# EAGLE design pm2011(4) (EAGLE 5.11)
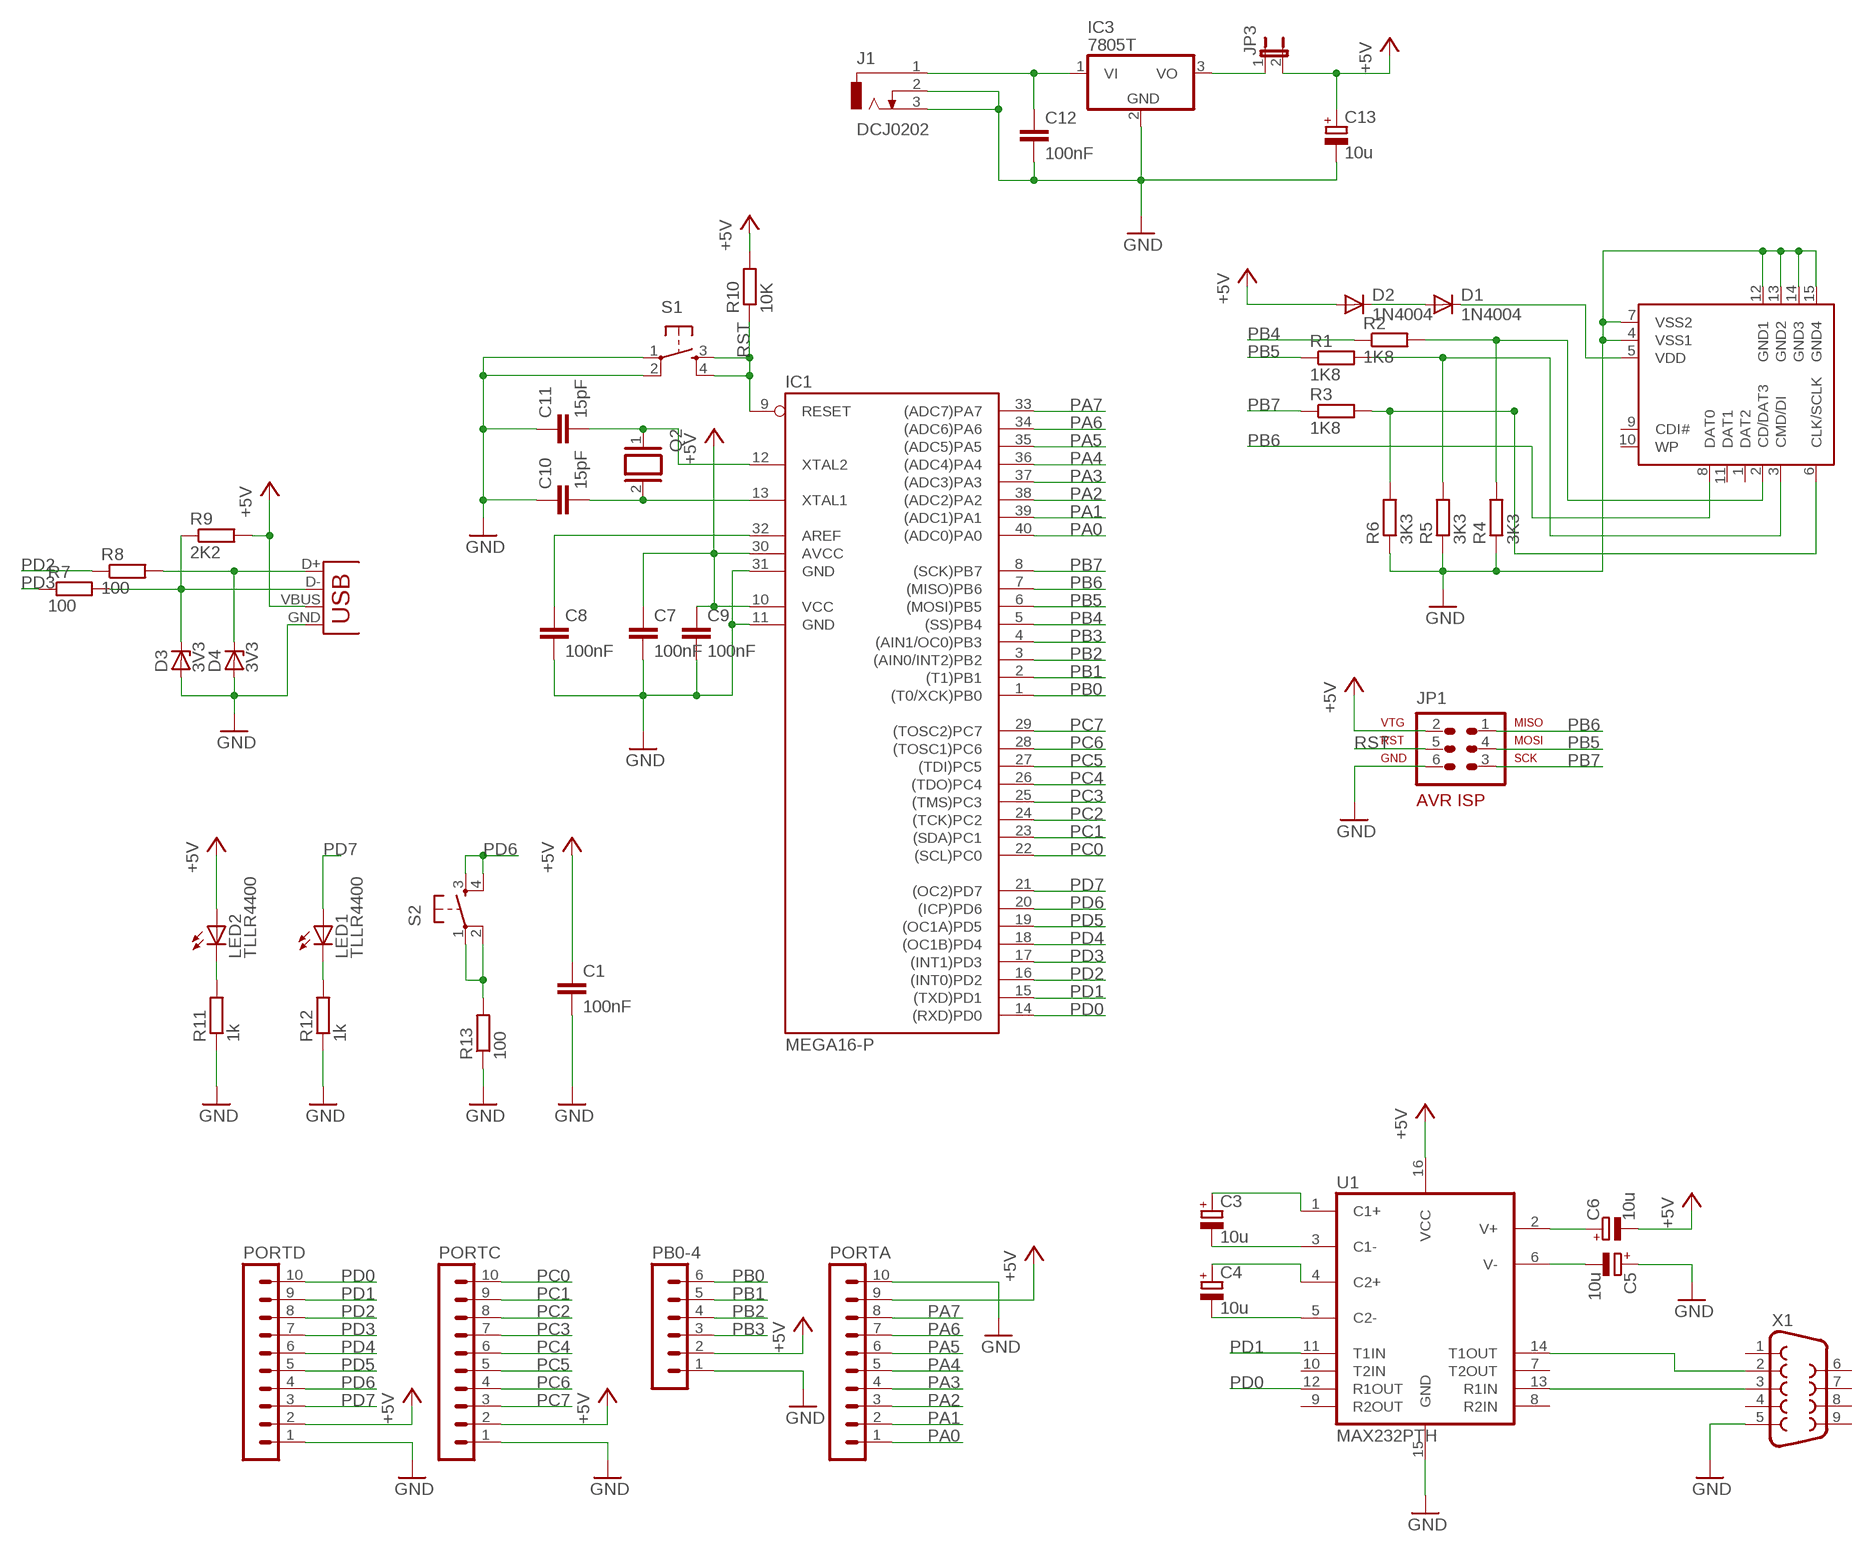
[diagram p0: schematic, sheet 1]

## Parts
C1  100nF  C-EU025-025X050  [C025-025X050]
C3  10u  CPOL-EUE2.5-5  [E2,5-5]
C4  10u  CPOL-EUE2.5-5  [E2,5-5]
C5  10u  CPOL-EUE2.5-5  [E2,5-5]
C6  10u  CPOL-EUE2.5-5  [E2,5-5]
C7  100nF  C-EU025-025X050  [C025-025X050]
C8  100nF  C-EU025-025X050  [C025-025X050]
C9  100nF  C-EU025-025X050  [C025-025X050]
C10  15pF  C-EU025-025X050  [C025-025X050]
C11  15pF  C-EU025-025X050  [C025-025X050]
C12  100nF  C-EU025-025X050  [C025-025X050]
C13  10u  CPOL-EUE2.5-5  [E2,5-5]
D1  1N4004  [DO41-10]
D2  1N4004  [DO41-10]
D3  3V3  ZENER-DIODEDO34-7  [DO34Z7]
D4  3V3  ZENER-DIODEDO34-7  [DO34Z7]
IC1  MEGA16-P  [DIL40]
IC3  7805T  [TO220H]
J1  DCJ0202  [DCJ0202]
JP1  AVR-ISP-6  [AVR-ISP-6]
JP3  JP1E  [JP1]
LED1  TLLR4400  [LED3MM]
LED2  TLLR4400  [LED3MM]
PB0-4  MA06-1  [MA06-1]
PORTA  MA10-1W  [MA10-1W]
PORTC  MA10-1W  [MA10-1W]
PORTD  MA10-1W  [MA10-1W]
Q2  XTAL/S  [QS]
R1  1K8  R-EU_M1206  [M1206]
R2  1K8  R-EU_M1206  [M1206]
R3  1K8  R-EU_M1206  [M1206]
R4  3K3  R-EU_M1206  [M1206]
R5  3K3  R-EU_M1206  [M1206]
R6  3K3  R-EU_M1206  [M1206]
R7  100  R-EU_0204/7  [0204/7]
R8  100  R-EU_0204/7  [0204/7]
R9  2K2  R-EU_0204/7  [0204/7]
R10  10K  R-EU_0204/7  [0204/7]
R11  1k  R-EU_0204/7  [0204/7]
R12  1k  R-EU_0204/7  [0204/7]
R13  100  R-EU_0204/7  [0204/7]
S1  TAC_SWITCHPTH  [TACTILE-PTH]
S2  TAC_SWITCHPTH  [TACTILE-PTH]
U1  MAX232PTH  [DIL16]
U$2  SDCARDVAR2  [SDCMF-10915W010]
X1  DB9  [DB9]
X2  USBPTH  [USB-B-PTH]

## Nets
+5V: C1.1 C6.- C7.1 C9.1 C13.+ D2.A IC1.10(VCC) IC1.30(AVCC) JP1.2 JP3.2 LED2.A PB0-4.2 PORTA.9 PORTC.2 PORTD.2 R9.2 R10.2 U1.16(VCC) X2.VBUS
GND: C1.2 C5.+ C7.2 C8.2 C9.2 C10.1 C11.1 C12.2 C13.- D3.A D4.A IC1.11(GND) IC1.31(GND) IC3.2(GND) J1.2 J1.3 JP1.6 PB0-4.1 PORTA.10 PORTC.1 PORTD.1 R4.1 R5.1 R6.1 R11.1 R12.1 R13.1 S1.1 S1.2 U1.15(GND) U$2.4(VSS1) U$2.7(VSS2) U$2.12(GND1) U$2.13(GND2) U$2.14(GND3) U$2.15(GND4) X1.5 X2.GND
N$1: C3.- U1.3(C1-)
N$2: C3.+ U1.1(C1+)
N$3: C4.- U1.5(C2-)
N$4: C4.+ U1.4(C2+)
N$5: C6.+ U1.2(V+)
N$6: C5.- U1.6(V-)
N$7: U1.14(T1OUT) X1.2
N$8: U1.13(R1IN) X1.3
N$9: D1.C U$2.5(VDD)
N$10: D1.A D2.C
N$11: R1.2 R5.2 U$2.3(CMD/DI)
N$12: R2.2 R4.2 U$2.2(CD/DAT3)
N$13: R3.2 R6.2 U$2.6(CLK/SCLK)
N$14: D4.C R8.2 X2.D+
N$15: D3.C R7.2 R9.1 X2.D-
N$16: C12.1 IC3.1(VI) J1.1
N$17: R13.2 S2.1 S2.2
N$18: IC3.3(VO) JP3.1
N$20: C8.1 IC1.32(AREF)
N$21: C10.2 IC1.13(XTAL1) Q2.2
N$22: C11.2 IC1.12(XTAL2) Q2.1
N$24: LED1.K(C) R12.2
N$25: LED2.K(C) R11.2
PA0: IC1.40((ADC0)PA0) PORTA.1
PA1: IC1.39((ADC1)PA1) PORTA.2
PA2: IC1.38((ADC2)PA2) PORTA.3
PA3: IC1.37((ADC3)PA3) PORTA.4
PA4: IC1.36((ADC4)PA4) PORTA.5
PA5: IC1.35((ADC5)PA5) PORTA.6
PA6: IC1.34((ADC6)PA6) PORTA.7
PA7: IC1.33((ADC7)PA7) PORTA.8
PB0: IC1.1((T0/XCK)PB0) PB0-4.6
PB1: IC1.2((T1)PB1) PB0-4.5
PB2: IC1.3((AIN0/INT2)PB2) PB0-4.4
PB3: IC1.4((AIN1/OC0)PB3) PB0-4.3
PB4: IC1.5((SS)PB4) R2.1
PB5: IC1.6((MOSI)PB5) JP1.4 R1.1
PB6: IC1.7((MISO)PB6) JP1.1 U$2.8(DAT0)
PB7: IC1.8((SCK)PB7) JP1.3 R3.1
PC0: IC1.22((SCL)PC0) PORTC.10
PC1: IC1.23((SDA)PC1) PORTC.9
PC2: IC1.24((TCK)PC2) PORTC.8
PC3: IC1.25((TMS)PC3) PORTC.7
PC4: IC1.26((TDO)PC4) PORTC.6
PC5: IC1.27((TDI)PC5) PORTC.5
PC6: IC1.28((TOSC1)PC6) PORTC.4
PC7: IC1.29((TOSC2)PC7) PORTC.3
PD0: IC1.14((RXD)PD0) PORTD.10 U1.12(R1OUT)
PD1: IC1.15((TXD)PD1) PORTD.9 U1.11(T1IN)
PD2: IC1.16((INT0)PD2) PORTD.8 R8.1
PD3: IC1.17((INT1)PD3) PORTD.7 R7.1
PD4: IC1.18((OC1B)PD4) PORTD.6
PD5: IC1.19((OC1A)PD5) PORTD.5
PD6: IC1.20((ICP)PD6) PORTD.4 S2.3 S2.4
PD7: IC1.21((OC2)PD7) LED1.A PORTD.3
RST: IC1.9(RESET) JP1.5 R10.1 S1.3 S1.4
Unconnected: U1.7(T2OUT) U1.8(R2IN) U1.9(R2OUT) U1.10(T2IN) U$2.1(DAT2) U$2.9(CDI#) U$2.10(WP) U$2.11(DAT1) X1.1 X1.4 X1.6 X1.7 X1.8 X1.9

## Library data of the parts
C1 C7-C12 = resistor:C-EU: CAPACITOR, European symbol
C3-C6 C13 = resistor:CPOL-EU: POLARIZED CAPACITOR, European symbol
D1 D2 = diode:1N4004: DIODE general purpose rectifier, 1 A
D3 D4 = diode:ZENER-DIODE: Z-Diode
IC1 = atmel:MEGA16-P: MICROCONTROLLER 16 Kbytes FLASH 1 kbytes SRAM 512 bytes EEPROM USART 8-channel 10 bit ADC Source: avr.lbr; MPN: ATMEGA16-16PU; OC_FARNELL: 9171142; OC_NEWARK: 01M6885
IC3 = linear:78*: Positive VOLTAGE REGULATOR Source: http://cache.national.com/ds/LM/LM78L05.pdf http://www.fairchildsemi.com/ds/LM/LM7805.pdf
J1 = con-jack:DCJ0202: DC POWER JACK Source: DCJ0202.pdf; OC_FARNELL: unknown; OC_NEWARK: unknown
JP1 = atmel-1:AVR-ISP-6: AVR ISP-6 Serial Programming Header
JP3 = jumper:JP1E: JUMPER
LED1 LED2 = led:TLLR4400: Low Current (2mA) LED 3 mm Tinted Diffused Package color RED Source: Data sheet <http://www.farnell.com/datasheets/391100.pdf>; MF: VISHAY SEMICONDUCTOR; OC_FARNELL: 1612437
PB0-4 = con-lstb:MA06-1: PIN HEADER; OC_FARNELL: unknown; OC_NEWARK: unknown
PORTA PORTC PORTD = con-lstb:MA10-1W: PIN HEADER; OC_FARNELL: unknown; OC_NEWARK: unknown
Q2 = special:XTAL/S: CRYSTAL
R1-R13 = resistor:R-EU_: RESISTOR, European symbol
S1 S2 = SparkFun:TAC_SWITCH: Momentary Switch Button commonly used for reset or general input. Spark Fun Electronics SKU : COM-00097
U1 = SparkFun:MAX232: RS232 Transceiver Very common IC. This is generically called 'MAX232', but works with the 3V equivalent MAX3232 generic ICs. Field tested and mother approved. Spark Fun Electronics SKU : COM-00316 (DIP) and COM-00589 (SMD)
U$2 = kingfont_sdcmf10915w010_covek:SDCARD: SD card connector KINGFONT SDCMF-10915W010
X1 = SparkFun:DB9: DB9 Connector Standard DB9 (D-Sub 9) serial connector. Can be used for CAN bus as well as RS485 and RS232. Footprint production proven. Spark Fun Electronics SKU : PRT-00429
X2 = SparkFun:USB: USB Connectors USB-B-PTH is fully proven SKU : PRT-00139 USB-miniB is fully proven SKU : PRT-00587 USB-A-PCB is untested. USB-A-H is throughly reviewed, but untested. Spark Fun Electronics SKU : PRT-00437 USB-B-SMT is throughly reviewed, but untested. Needs silkscreen touching up. USB-A-S has not been used/tested USB-MB-H has not been used/tested

## Board
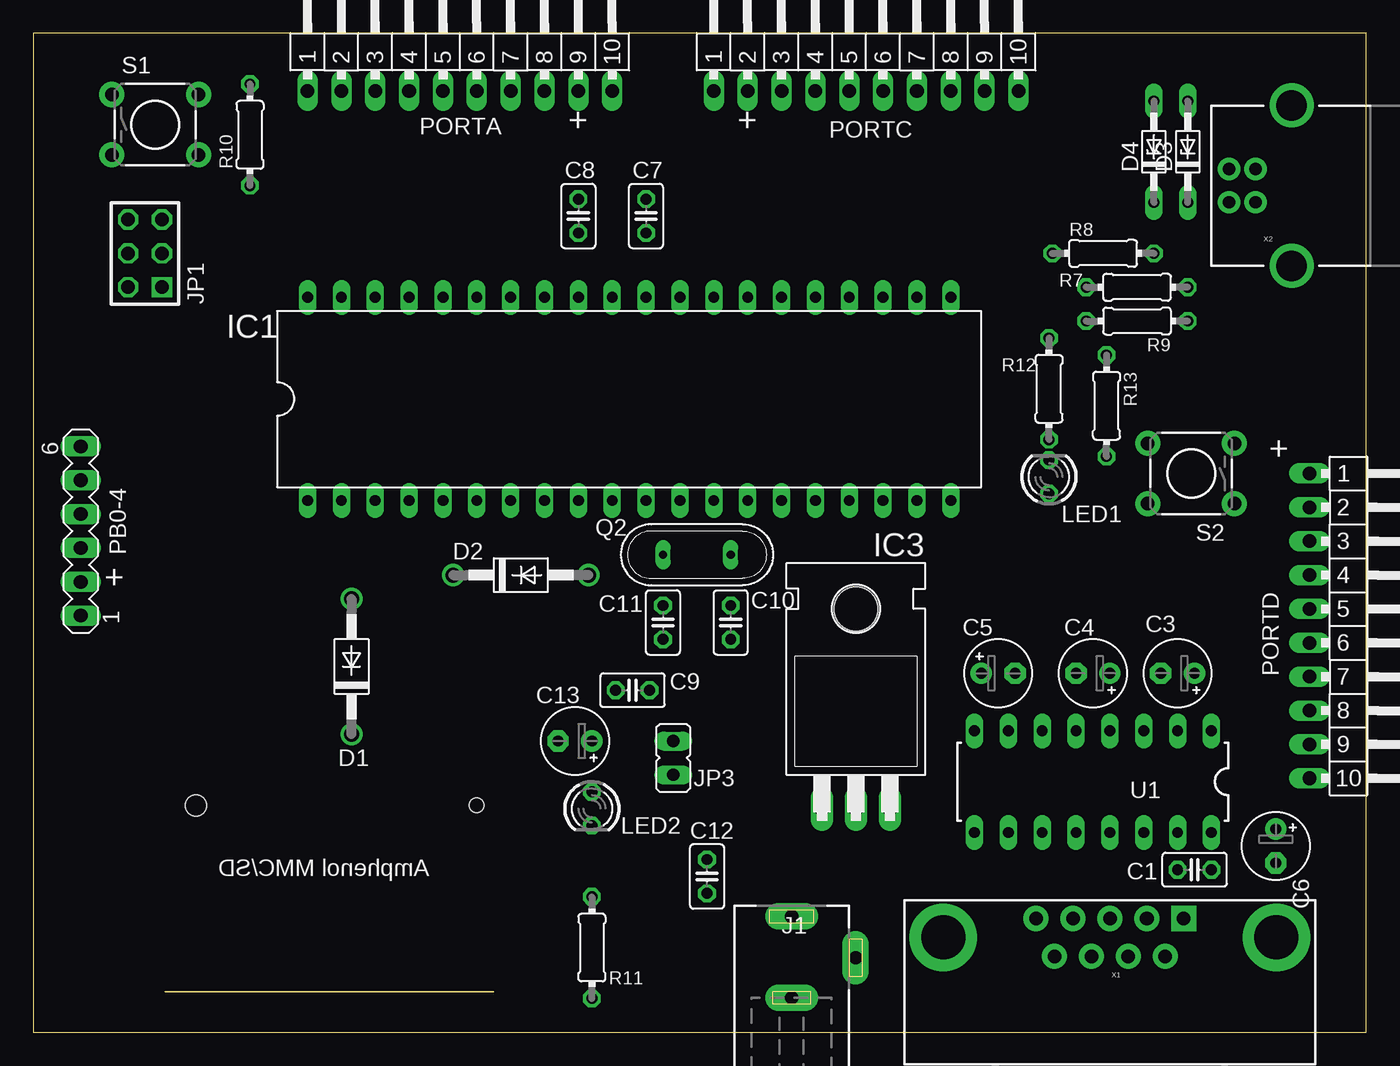
[diagram p1: board, top side]
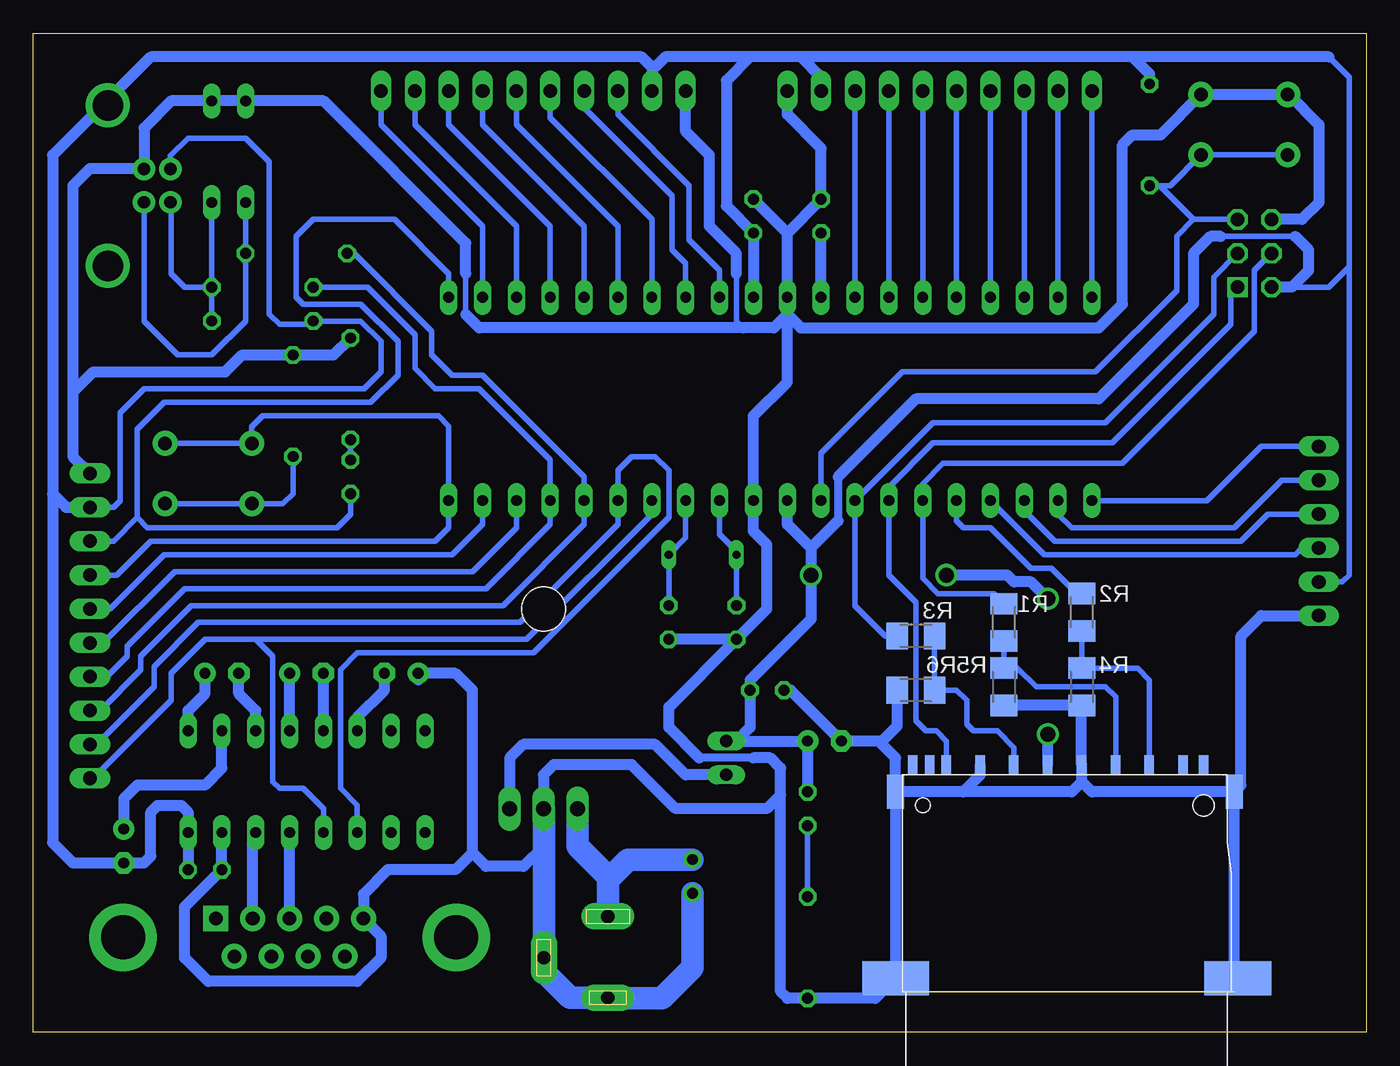
[diagram p2: board, bottom side, seen from below]

Size 100 x 74.92 mm. Coordinates in mm from the lower left corner, seen from the top.
Outline: 0,0 100,0 100,74.92 0,74.92 0,0
Copper layers (1*16): Top 0.035mm / dielectric 1.5mm / Bottom 0.035mm
Design rules "10mils": minimum track width 10mil, minimum drill 24mil, track to track 10mil, track to pad 10mil, pad to pad 10mil, via to via 10mil, smd to smd 10mil, copper to edge 40mil, drill to drill 10mil, minimum pad ring 10mil, minimum via ring 8mil, stop-mask expansion 0mil, vias tented up to drill 0mil, thermal gap 10mil

### Footprints (pad centres in the part's own frame; a part is rotated, then mirrored left to right if it is on the bottom)
C025-025X050 = drill 0.813 octagon: 1 -1.27,0; 2 1.27,0
E2,5-5 = drill 0.813 pad 1.6 round: + -1.27,0 | drill 0.813 pad 1.6 octagon: - 1.27,0
DO41-10 = drill 1.118 round: A 5.08,0; C -5.08,0
DO34Z7 = drill 0.813 long: A 3.81,0; C -3.81,0
DIL40 = drill 0.813 long: 1 -24.13,-7.62; 2 -21.59,-7.62; 3 -19.05,-7.62; 4 -16.51,-7.62; 5 -13.97,-7.62; 6 -11.43,-7.62; 7 -8.89,-7.62; 8 -6.35,-7.62; 9 -3.81,-7.62; 10 -1.27,-7.62; 11 1.27,-7.62; 12 3.81,-7.62; 13 6.35,-7.62; 14 8.89,-7.62; 15 11.43,-7.62; 16 13.97,-7.62; 17 16.51,-7.62; 18 19.05,-7.62; 19 21.59,-7.62; 20 24.13,-7.62; 21 24.13,7.62; 22 21.59,7.62; 23 19.05,7.62; 24 16.51,7.62; 25 13.97,7.62; 26 11.43,7.62; 27 8.89,7.62; 28 6.35,7.62; 29 3.81,7.62; 30 1.27,7.62; 31 -1.27,7.62; 32 -3.81,7.62; 33 -6.35,7.62; 34 -8.89,7.62; 35 -11.43,7.62; 36 -13.97,7.62; 37 -16.51,7.62; 38 -19.05,7.62; 39 -21.59,7.62; 40 -24.13,7.62
TO220H = drill 1.118 long: 1 -2.54,-10.16; 2 0,-10.16; 3 2.54,-10.16 | hole 3.302: 0,4.826
DCJ0202 = drill 1 pad 2 long: 1 0,3.1; 2 4.8,0; 3 0,-3
AVR-ISP-6 = drill 1.016 square: 1 -2.54,-1.27 | drill 1.016 octagon: 2 -2.54,1.27; 3 0,-1.27; 4 0,1.27; 5 2.54,-1.27; 6 2.54,1.27
JP1 = drill 0.914 long: 1 0,-1.27; 2 0,1.27
LED3MM = drill 0.813 octagon: A -1.27,0; K 1.27,0
MA06-1 = drill 1.016 long: 1 -6.35,0; 2 -3.81,0; 3 -1.27,0; 4 1.27,0; 5 3.81,0; 6 6.35,0
MA10-1W = drill 1.016 long: 1 -11.43,0; 2 -8.89,0; 3 -6.35,0; 4 -3.81,0; 5 -1.27,0; 6 1.27,0; 7 3.81,0; 8 6.35,0; 9 8.89,0; 10 11.43,0
QS = drill 0.61 long: 1 -2.54,0; 2 2.54,0
M1206 = smd 1.6 x 2: 1 -1.4,0; 2 1.4,0
0204/7 = drill 0.813 octagon: 1 -3.81,0; 2 3.81,0
TACTILE-PTH = drill 1.016 pad 1.88 round: 1 -3.251,2.261; 2 3.251,2.261; 3 -3.251,-2.261; 4 3.251,-2.261
DIL16 = drill 0.813 long: 1 -8.89,-3.81; 2 -6.35,-3.81; 3 -3.81,-3.81; 4 -1.27,-3.81; 5 1.27,-3.81; 6 3.81,-3.81; 7 6.35,-3.81; 8 8.89,-3.81; 9 8.89,3.81; 10 6.35,3.81; 11 3.81,3.81; 12 1.27,3.81; 13 -1.27,3.81; 14 -3.81,3.81; 15 -6.35,3.81; 16 -8.89,3.81
SDCMF-10915W010 = smd 0.711 x 1.422: 1 8.366,13.462; 2 5.826,13.462; 3 3.286,13.462; 4 0.746,13.462; 5 -1.794,13.462; 6 -4.334,13.462; 7 -6.874,13.462; 8 -9.398,13.462; 9 9.906,13.462; 10 -11.938,13.462; 11 -10.668,13.462 | smd 1.27 x 2.54: 12 12.192,11.43; 15 -13.208,11.43 | smd 5 x 2.54: 13 12.47,-2.54; 14 -13.208,-2.54 | hole 1.6: 9.906,10.414 | hole 1.1: -11.176,10.414
DB9 = drill 1.016 pad 1.88 square: 1 -5.54,-1.42 | drill 1.016 pad 1.88 round: 2 -2.77,-1.42; 3 0,-1.42; 4 2.77,-1.42; 5 5.54,-1.42; 6 -4.15,1.42; 7 -1.38,1.42; 8 1.38,1.42; 9 4.15,1.42 | drill 3.302 pad 5.08 round: G1 -12.5,0; G2 12.5,0
USB-B-PTH = drill 0.914 pad 1.676 round: D+ 0,1.25; D- 1.981,1.25; GND 0,-1.25; VBUS 1.981,-1.25 | drill 2.286 round: P$1 -2.718,-6.02; P$2 -2.718,6.02

### Placement (x,y rotation side)
C1  87.12,12.19 180 top
C3  85.85,26.92 180 top
C4  79.5,26.92 180 top
C5  72.39,26.92 0 top
C6  93.22,13.97 270 top
C7  45.97,61.21 90 top
C8  40.89,61.21 90 top
C9  44.96,25.65 180 top
C10  52.32,30.73 90 top
C11  47.24,30.73 90 top
C12  50.55,11.68 270 top
C13  40.64,21.84 180 top
D1  23.88,27.43 90 top
D2  36.58,34.29 0 top
D3  86.61,66.04 90 top
D4  84.07,66.04 90 top
IC1  44.7,47.5 0 top
IC3  61.72,26.92 0 top
J1  56.9,5.59 0 top
JP1  8.38,58.42 90 top
JP3  48.01,20.57 0 top
LED1  76.2,41.66 90 top
LED2  41.91,16.76 270 top
PB0-4  3.56,37.59 90 top
PORTA  32,70.61 0 top
PORTC  62.48,70.61 0 top
PORTD  95.76,30.48 270 top
Q2  49.78,35.81 0 top
R1  27.18,30.73 270 bottom
R2  21.34,31.5 270 bottom
R3  33.78,29.72 0 bottom
R4  21.34,25.91 90 bottom
R5  27.18,25.91 90 bottom
R6  33.78,25.65 0 bottom
R7  82.8,55.88 0 top
R8  80.26,58.42 0 top
R9  82.8,53.34 180 top
R10  16.26,67.31 90 top
R11  41.91,6.35 90 top
R12  76.2,48.26 270 top
R13  80.52,46.99 270 top
S1  9.14,68.07 0 top
S2  86.87,41.91 180 top
U1  79.5,18.8 180 top
U$2  22.1,6.6 0 bottom
X1  80.77,7.11 180 top
X2  91.69,63.5 180 top

### Tracks (layer width: path | path; a pad name or v marks a point on that pad's centre or on a via)
+5V
  Bottom 0.406: 5.33,59.69 10.92,59.69 | 90.17,48.26 75.18,48.26 73.91,49.53 73.91,51.82 75.44,53.34 R9.2 79.25,53.09 81.53,53.09 82.3,53.85 82.3,65.28 84.07,67.06 88.39,67.06 89.71,65.73 X2.VBUS | 90.17,48.26 90.42,48.26 | PB0-4.2 1.78,33.78 1.27,34.29 1.27,57.4 | 1.27,57.4 1.27,71.63 2.79,73.15 | 5.59,55.88 2.79,55.88 1.27,57.4 | PORTD.2 93.98,39.37 93.47,39.88 93.47,46.48 91.69,48.26 90.17,48.26
  Bottom 0.61: 39.62,41.66 39.62,38.35
  Bottom 0.813: 41.66,36.32 D2.A 41.66,30.99 46.23,26.42 C9.1 46.23,22.86 47.24,21.84 JP3.2 C13.+ LED2.A | 41.66,36.32 43.43,38.1 IC1.10 | 39.62,38.35 41.66,36.32 | 39.62,41.66 33.78,47.5 20.07,47.5 12.95,54.61 12.95,58.42 11.68,59.69 10.92,59.69 | 53.59,72.39 PORTC.2 | 53.59,72.39 54.36,73.15 91.19,73.15 98.55,65.79 98.55,40.39 | C1.1 U1.16 88.39,16.51 88.9,17.02 90.68,17.02 91.19,16.51 91.19,13.21 91.69,12.7 C6.- 97.03,12.7 98.55,14.22 98.55,40.39 | 53.59,72.39 53.34,72.39 52.58,73.15 46.23,73.15 | 42.42,73.15 46.23,73.15 | PORTA.9 40.89,71.63 42.42,73.15 | IC1.30 C7.1 48.01,61.98 48.01,71.37 46.23,73.15 | 2.79,73.15 17.53,73.15 | 17.53,73.15 42.42,73.15 | 5.33,59.69 4.32,58.67 4.32,57.15 5.59,55.88 JP1.2 | R10.2 16.26,71.88 17.53,73.15 | PORTD.2 97.54,39.37 98.55,40.39
GND
  Bottom 0.406: 28.96,20.05 U$2.7 | 67.56,53.85 67.56,56.9 | 47.24,56.9 47.24,53.34 46.74,52.83
  Bottom 0.61: 45.97,20.57 50.04,20.57
  Bottom 0.813: 43.43,53.85 43.43,48.77 45.97,46.23 IC1.11 45.97,37.59 44.96,36.58 44.96,31.75 C11.1 | 43.43,53.85 IC1.31 43.43,59.94 | C11.1 C10.1 | U1.15 C1.2 88.65,9.4 88.65,5.59 86.87,3.81 75.69,3.81 73.91,5.59 73.91,7.21 X1.5 75.23,10.37 73.41,12.19 68.33,12.19 67.06,13.46 | 43.43,59.94 C7.2 | 43.43,59.94 C8.2 40.89,66.29 43.43,68.83 PORTA.10 | PORTC.1 51.05,67.56 49.28,65.79 49.28,60.45 47.24,58.42 47.24,56.9 | 43.43,53.85 44.45,52.83 46.74,52.83 66.55,52.83 67.56,53.85 | 67.56,56.9 67.56,59.18 78.23,69.85 D4.A D3.A 89.66,69.85 91.69,67.82 X2.GND 91.71,64.77 95.76,64.77 97.03,63.5 97.03,48.01 | R12.1 77.47,50.8 R13.1 84.33,50.8 85.6,49.53 95.5,49.53 97.03,48.01 | 43.43,53.85 42.42,52.83 20.07,52.83 18.29,54.61 18.29,66.55 17.53,67.31 15.42,67.31 S1.2 S1.1 5.82,70.33 3.56,68.07 3.56,62.23 4.83,60.96 JP1.6 | 71.12,26.42 C5.+ 68.33,26.92 67.06,25.65 67.06,13.46 | 67.06,13.46 66.04,12.45 63.22,12.45 61.7,13.97 | IC3.2 61.72,19.3 60.96,20.07 55.12,20.07 51.82,16.76 44.96,16.76 43.94,17.78 | 43.94,17.78 43.94,3.05 43.43,2.54 R11.1 36.83,2.54 U$2.14 U$2.15 | 43.94,17.78 43.94,19.81 44.7,20.57 45.97,20.57 | PB0-4.1 7.87,31.24 9.4,29.72 9.4,18.54 U$2.12 | U$2.12 9.91,4.34 U$2.13 | U$2.12 20.57,18.03 21.34,18.8 | 21.34,18.8 21.34,20.05 U$2.4 21.35,24.49 R4.1 R5.1 | 30.23,18.03 22.1,18.03 21.34,18.8 | 30.23,18.03 U$2.15 | 28.96,20.05 28.96,19.3 30.23,18.03 | C9.2 43.18,25.65 C13.- 36.58,21.84 36.45,21.72 | 36.45,21.72 35.31,20.57 U$2.15 | R6.1 35.18,22.98 36.45,21.72 | 50.04,20.57 52.32,22.86 52.32,24.38 C11.1 | 97.03,48.01 97.03,43.18 PORTD.1
  Bottom 1.676: C12.2 50.55,4.83 52.83,2.54 56.85,2.54 J1.3 59.74,2.59 61.72,4.57 61.72,5.56 J1.2 61.7,13.97 61.7,16.74 IC3.2
N$1
  Bottom 0.813: U1.3 83.31,24.13 84.58,25.4 C3.-
N$2
  Bottom 0.813: U1.1 88.39,24.13 87.12,25.4 C3.+
N$3
  Bottom 0.813: U1.5 C4.-
N$4
  Bottom 0.813: U1.4 C4.+
N$5
  Bottom 0.813: U1.2 85.85,19.81 87.12,18.54 92.2,18.54 93.22,17.53 C6.+
N$6
  Bottom 0.813: U1.6 75.69,23.62 73.66,25.65 C5.-
N$7
  Bottom 0.813: X1.2 83.54,14.76 U1.14
N$8
  Bottom 0.813: X1.3 U1.13
N$9
  Bottom 0.813: U$2.5 23.89,22.34 D1.C
N$10
  Bottom 0.813: D1.A 25.15,33.78 26.42,33.78 26.92,34.29 D2.C
N$11
  Bottom 0.406: U$2.3 18.8,20.07 18.8,25.15 19.56,25.91 24.76,25.91 26.16,27.31 R5.2 R1.2
N$12
  Bottom 0.406: R2.2 R4.2 17.15,27.31 16.26,26.42 16.26,20.08 U$2.2
N$13
  Bottom 0.406: R3.2 R6.2 30.73,25.65 29.97,24.89 29.97,23.11 29.46,22.61 27.69,22.61 26.42,21.34 26.42,20.08 U$2.6
N$14
  Bottom 0.406: D4.C R8.2 84.07,53.34 86.61,50.8 89.15,50.8 91.69,53.34 X2.D+
N$15
  Bottom 0.406: R9.1 R7.2 | R7.2 D3.C | R7.2 88.65,55.88 89.66,56.9 89.66,62.2 X2.D-
N$16
  Bottom 1.676: J1.1 56.9,11.43 56.77,11.56 | 56.77,11.56 55.37,12.95 C12.1 | IC3.1 59.18,13.97 56.77,11.56
N$17
  Bottom 0.406: S2.1 S2.2 83.59,39.62 81.28,39.62 80.52,40.39 R13.2
N$18
  Bottom 0.813: 64.26,18.29 IC3.3 64.26,20.57 63.25,21.59 53.34,21.59 51.05,19.3 JP3.1
N$20
  Bottom 0.813: IC1.32 C8.1
N$21
  Bottom 0.406: IC1.13 51.05,37.08 Q2.2 C10.2
N$22
  Bottom 0.406: C11.2 Q2.1 47.24,36.07 48.51,37.34 IC1.12
N$24
  Bottom 0.406: LED1.K R12.2
N$25
  Bottom 0.406: R11.2 LED2.K
PA0
  Bottom 0.406: IC1.40 PORTA.1
PA1
  Bottom 0.406: IC1.39 PORTA.2
PA2
  Bottom 0.406: IC1.38 PORTA.3
PA3
  Bottom 0.406: IC1.37 PORTA.4
PA4
  Bottom 0.406: IC1.36 PORTA.5
PA5
  Bottom 0.406: IC1.35 PORTA.6
PA6
  Bottom 0.406: IC1.34 PORTA.7
PA7
  Bottom 0.406: IC1.33 PORTA.8
PB0
  Bottom 0.406: PB0-4.6 5.08,43.94 | 5.08,43.94 5.33,43.94 | IC1.1 11.94,39.88 7.87,43.94 5.08,43.94
PB1
  Bottom 0.406: PB0-4.5 6.35,41.4 9.91,37.85 22.1,37.85 23.11,38.86 IC1.2
PB2
  Bottom 0.406: PB0-4.4 7.37,38.86 9.4,36.83 23.37,36.83 25.65,39.12 IC1.3
PB3
  Bottom 0.406: IC1.4 24.13,35.81 5.33,35.81 4.83,36.32 PB0-4.3 3.3,36.58
PB4
  Bottom 0.406: R2.1 21.72,32.9 23.62,34.8 25.15,34.8 28.19,37.85 30.23,37.85 30.73,38.35 IC1.5
PB5
  Bottom 0.406: JP1.4 8.38,57.15 8.38,52.58 18.29,42.67 31.75,42.67 33.27,41.15 IC1.6 33.27,34.04 32.13,32.9 27.94,32.9 R1.1
PB6
  Bottom 0.406: JP1.1 10.16,55.37 10.16,53.09 19.05,44.2 32.51,44.2 35.81,40.89 IC1.7 35.81,34.29 33.78,32.26 33.78,23.37 33.02,22.61 32.26,22.61 31.5,21.84 U$2.8
PB7
  Bottom 0.406: R3.1 36.07,29.72 38.35,32 IC1.8 32.51,45.72 19.56,45.72 11.43,53.85 11.43,56.64 JP1.3
PC0
  Bottom 0.406: PORTC.10 73.91,68.07 66.29,60.45 IC1.22
PC1
  Bottom 0.406: PORTC.9 71.37,68.07 63.75,60.45 IC1.23
PC2
  Bottom 0.406: PORTC.8 68.83,68.07 61.21,60.45 IC1.24
PC3
  Bottom 0.406: PORTC.7 66.29,68.07 58.67,60.45 IC1.25
PC4
  Bottom 0.406: PORTC.6 63.75,68.07 56.13,60.45 IC1.26
PC5
  Bottom 0.406: PORTC.5 61.21,68.58 53.59,60.96 IC1.27
PC6
  Bottom 0.406: PORTC.4 58.67,69.34 52.07,62.74 52.07,58.67 51.05,57.66 IC1.28
PC7
  Bottom 0.406: IC1.29 48.51,57.15 50.8,59.44 50.8,63.5 56.13,68.83 PORTC.3
PD0
  Bottom 0.406: IC1.14 53.59,38.86 62.99,29.46 83.31,29.46 | 83.31,29.46 82.04,28.19 82.04,18.8 81.53,18.29 79.76,18.29 78.23,16.76 U1.12 | PORTD.10 95.5,19.05 89.66,24.89 89.66,26.92 87.12,29.46 83.31,29.46
PD1
  Bottom 0.406: U1.11 75.69,17.02 76.96,18.29 76.96,27.18 75.69,28.45 62.48,28.45 52.32,38.61 52.32,42.16 53.34,43.18 55.12,43.18 56.13,42.16 IC1.15 56.13,38.1 63.5,30.73 87.63,30.73 90.93,27.43 90.93,25.91 95.25,21.59 PORTD.9
PD2
  Bottom 0.406: R8.1 75.95,58.42 70.1,52.58 70.1,50.8 68.58,49.28 66.29,49.28 58.67,41.66 IC1.16 58.67,38.1 64.77,32 88.14,32 91.95,28.19 91.95,27.18 95,24.13 PORTD.8
PD3
  Bottom 0.406: 87.63,33.27 66.04,33.27 61.21,38.1 IC1.17 61.21,42.93 66.55,48.26 69.85,48.26 71.37,49.78 71.37,52.32 74.93,55.88 R7.1 | 87.63,33.27 87.88,33.27 | PORTD.7 94.49,26.67 92.96,28.19 92.96,28.96 88.65,33.27 87.63,33.27
PD4
  Bottom 0.406: IC1.18 63.75,37.85 67.06,34.54 89.41,34.54 94.74,29.21 PORTD.6
PD5
  Bottom 0.406: IC1.19 66.29,38.1 68.58,35.81 90.17,35.81 94.23,31.75 PORTD.5
PD6
  Bottom 0.406: S2.3 S2.4 83.62,45.41 82.8,46.23 69.6,46.23 68.83,45.47 IC1.20 68.83,37.85 69.85,36.83 91.19,36.83 93.73,34.29 PORTD.4
PD7
  Bottom 0.406: LED1.A 76.2,38.86 77.22,37.85 91.44,37.85 92.2,38.61 | 92.2,38.61 92.2,45.21 90.17,47.24 74.68,47.24 72.64,49.28 72.64,51.82 75.44,54.61 79.76,54.61 80.26,55.12 80.26,59.69 78.99,60.96 72.9,60.96 68.83,56.9 68.83,55.63 68.58,55.37 IC1.21 | PORTD.3 93.98,36.83 92.2,38.61
RST
  Bottom 0.406: S1.3 S1.4 14.71,63.5 15.49,63.5 | 15.49,63.5 R10.1 | 12.95,60.96 14.22,59.69 14.22,55.63 20.32,49.53 34.8,49.53 40.89,43.43 IC1.9 | 12.95,60.96 JP1.5 | 12.95,60.96 15.49,63.5

### Text on the board
tNames: + | + | + | +